# Altium schematic sheet FOTA MCU ICSP Communication.SchDoc: FOTA MCU ICSP Communication Socket
size A4
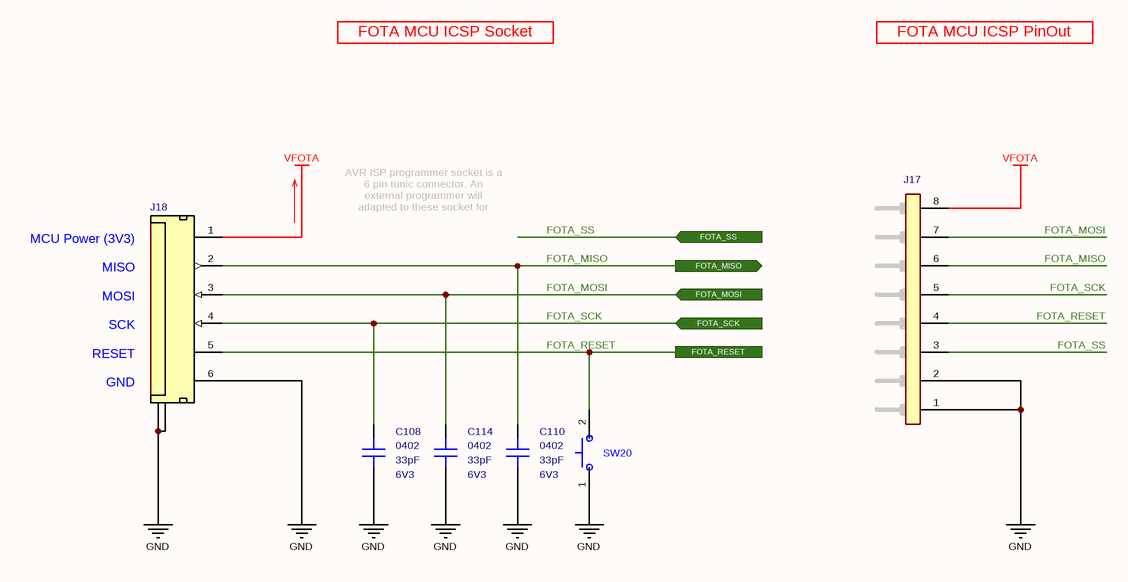
[diagram p0: FOTA MCU ICSP Communication.SchDoc]

## Parts
C108  value 33pF  Case: 0402  Voltage: 6V3  [CAPACITOR_0402]  (hidden comment: Multilayer Ceramic Capacitor)
C110  value 33pF  Case: 0402  Voltage: 6V3  [CAPACITOR_0402]  (hidden comment: Multilayer Ceramic Capacitor)
C114  value 33pF  Case: 0402  Voltage: 6V3  [CAPACITOR_0402]  (hidden comment: Multilayer Ceramic Capacitor)
J17  2.54 mm Pitch 8P Male Connector  [8P Header]  (value not drawn)
J18  6P Tunic Connector  [Connector_Tunic 6P - H]  (value not drawn)
SW20  Tactile Switches  [PTS526_Switch]  (value not drawn)

## Ports
FOTA_MISO (out), FOTA_MOSI (in), FOTA_RESET, FOTA_SCK (in), FOTA_SS (in)

## Nets
GND: C108.2 C110.2 C114.2 J17.1(Pin-1) J17.2(Pin-2) J18.6(M_DRV) J18.7(GND) J18.8(GND) SW20.1(NC)
VFOTA: J17.8(Pin-8) J18.1(VBAT)
FOTA_MISO: C110.1 J17.6(Pin-6) J18.2(M_DRV) ; port FOTA_MISO
FOTA_MOSI: C114.1 J17.7(Pin-7) J18.3(M_DRV) ; port FOTA_MOSI
FOTA_RESET: J17.4(Pin-4) J18.5(M_DRV) SW20.2(COM) ; port FOTA_RESET
FOTA_SCK: C108.1 J17.5(Pin-5) J18.4(M_DRV) ; port FOTA_SCK
FOTA_SS: J17.3(Pin-3) ; port FOTA_SS

## Notes on the sheet
- FOTA MCU ICSP Socket
- FOTA MCU ICSP PinOut
- AVR ISP programmer socket is a 6 pin tunic connector. An external programmer will adapted to these socket for programming MCU.
- (near J18) MCU Power (3V3)
  MISO
  MOSI
  SCK
  RESET
  GND
- Title
- Size:
- Date:
- A4
- Number:
- Time:
- Revision:
- Sheet
- of
- File:

## Library data of the parts
C108 C110 C114 = Capacitor - 33pF [0402-6V3]: Capacitor - 33pF [0402] (Ceramic); Manufacturer_Name: Kemet; Manufacturer_Part_Number: C0402C330J9RACAUTO; Dielectric: X7R; Tolerance: 10%; Height: 0.5mm; Mouser_Part_Number: 80-C0402C330J9RAUTO; Maximum Operating Temperature: +125; Minimum Operating Temperature: -55; ROHS: Yes; ComponentLink1Description: DataSheet; ComponentLink1URL: https://api.kemet.com/component-edge/download/datasheet/C0402C330J9RACAUTO.pdf; ComponentLink2Description: Mouser; ComponentLink2URL: https://www.mouser.com/Search/Refine.aspx?Keyword=80-C0402C330J9RAUTO; Supplier 1: Mouser; Supplier Part Number 1: 80-C0402C330J9RAUTO
J17 = Connector - Male Header 8P (2.54): Headers & Wire Housings BREAKAWAY HDR VERT 8; Manufacturer Name: Molex; Position: 8; Row: 1; Pitch: 2.54 mm; Manufacturer Part Number: 22-28-4083; Mouser Part Number: 538-22-28-4083; ROHS: Yes; ComponentLink1Description: DataSheet; ComponentLink1URL: https://www.mouser.com.tr/datasheet/2/276/0022284063_PCB_HEADERS-228265.pdf; ComponentLink2Description: Mouser; ComponentLink2URL: https://www.mouser.com.tr/ProductDetail/Molex/22-28-4083/?qs=%2Fha2pyFaduguMWEp6M%252Bj0x6fHxUvnRGD%252BIxBoa6MO5w%3D
J18 = Connector - Mini Tunic 6P (1.25): Mini Tunic Connector with 6P; Manufacturer_Name: Molex; Manufacturer_Part_Number: 53261-0671; ROHS: Yes; Supplier 1: Avnet; Supplier 2: Mouser; Supplier 3: Arrow; Supplier 4: Farnell; Supplier 5: Newark; Supplier 6: Digi-Key; Supplier Part Number 1: 0532610671; Supplier Part Number 2: 538-53261-0671; Supplier Part Number 3: 53261-0671; Supplier Part Number 4: 1125375; Supplier Part Number 5: 93K4246; Supplier Part Number 6: WM7624CT-ND; System: Connector
SW20 = Switch - Tactile: Tactile Switches 50mA 12VDC, 5.2x5.2mm, 0.8mm H, 260gf, G leads.; Manufacturer Name: C&K Switches; Manufacturer Part Number: PTS526 SK08 SMTR2 LFS; Height: 0.8mm; Mouser Part Number: 611-PTS526SK08SMTR2L; ComponentLink1Description: DataSheet; ComponentLink1URL: https://eu.mouser.com/datasheet/2/60/pts526-1651200.pdf; ComponentLink2Description: Mouser; ComponentLink2URL: https://eu.mouser.com/ProductDetail/CK/PTS526-SK08-SMTR2-LFS?qs=sGAEpiMZZMsgGjVA3toVBL%2FRce%252ByN3s1hQPqiLlQ%252BeM%3D; Supplier 1: Future Electronics; Supplier 2: Mouser; Supplier 3: Arrow; Supplier 4: Digi-Key; Supplier Part Number 1: PTS526SK08SMTR2LFS-REEL; Supplier Part Number 2: 611-PTS526SK08SMTR2L; Supplier Part Number 3: PTS526 SK08 SMTR2 LFS; Supplier Part Number 4: CKN12219-1-ND